# Altium schematic sheet Main.SchDoc
size A4; CompanyName: WEITI ISE; Address1: ul. Nowowiejska 15/19; Address2: 00-665 Warszawa; DocumentNumber: 1; SheetNumber: 1; SheetTotal: 7
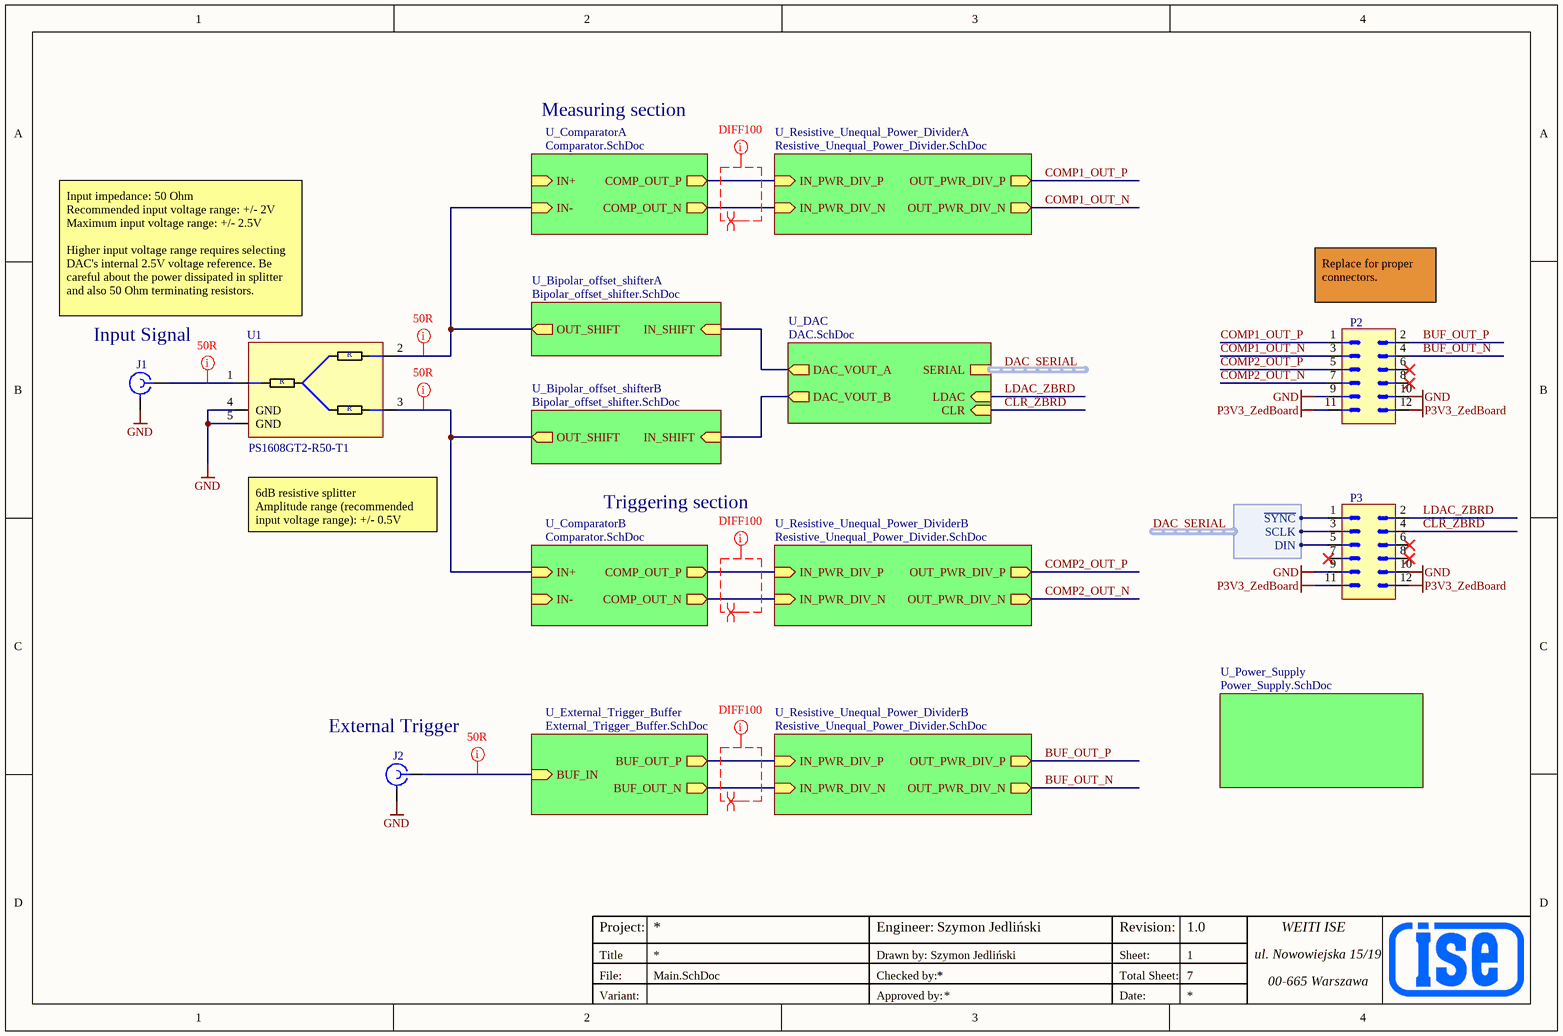
[diagram p0: Main.SchDoc]

## Parts
J1  CONSMA020.062-G  (value not drawn)
J2  CONSMA020.062-G  (value not drawn)
P2  DF11-12DP-2DSA  [DF11-12DP-2DSA]  (value not drawn)
P3  DF11-12DP-2DSA  [DF11-12DP-2DSA]  (value not drawn)
U1  PS1608GT2-R50-T1

## Sub-sheets
U_Bipolar_offset_shifterA = Bipolar_offset_shifter.SchDoc: OUT_SHIFT (out), IN_SHIFT (in)
U_Bipolar_offset_shifterB = Bipolar_offset_shifter.SchDoc: OUT_SHIFT (out), IN_SHIFT (in)
U_ComparatorA = Comparator.SchDoc: IN+ (in), IN- (in), COMP_OUT_P (out), COMP_OUT_N (out)
U_ComparatorB = Comparator.SchDoc: IN- (in), IN+ (in), COMP_OUT_P (out), COMP_OUT_N (out)
U_DAC = DAC.SchDoc: SERIAL (harness SERIAL_DAC), LDAC (in), CLR (in), DAC_VOUT_A (out), DAC_VOUT_B (out)
U_External_Trigger_Buffer = External_Trigger_Buffer.SchDoc: BUF_IN (in), BUF_OUT_P (out), BUF_OUT_N (out)
U_Power_Supply = Power_Supply.SchDoc: no entries
U_Resistive_Unequal_Power_DividerA = Resistive_Unequal_Power_Divider.SchDoc: IN_PWR_DIV_P (in), OUT_PWR_DIV_P (out), IN_PWR_DIV_N (in), OUT_PWR_DIV_N (out)
U_Resistive_Unequal_Power_DividerB = Resistive_Unequal_Power_Divider.SchDoc: IN_PWR_DIV_P (in), OUT_PWR_DIV_P (out), IN_PWR_DIV_N (in), OUT_PWR_DIV_N (out)
U_Resistive_Unequal_Power_DividerB = Resistive_Unequal_Power_Divider.SchDoc: IN_PWR_DIV_P (in), OUT_PWR_DIV_P (out), IN_PWR_DIV_N (in), OUT_PWR_DIV_N (out)

## Harnesses
SERIAL_DAC: DIN, SCLK, ~{SYNC}

## Nets
GND: J1.2 J2.2 P2.9 P2.10 P3.9 P3.10 U1.4(GND) U1.5(GND)
P3V3_ZedBoard: P2.11 P2.12 P3.11 P3.12
BUF_OUT_N: P2.4 ; sheet U_Resistive_Unequal_Power_DividerB/OUT_PWR_DIV_N
BUF_OUT_P: P2.2 ; sheet U_Resistive_Unequal_Power_DividerB/OUT_PWR_DIV_P
CLR_ZBRD: P3.4 ; sheet U_DAC/CLR
COMP1_OUT_N: P2.3 ; sheet U_Resistive_Unequal_Power_DividerA/OUT_PWR_DIV_N
COMP1_OUT_P: P2.1 ; sheet U_Resistive_Unequal_Power_DividerA/OUT_PWR_DIV_P
COMP2_OUT_N: P2.7 ; sheet U_Resistive_Unequal_Power_DividerB/OUT_PWR_DIV_N
COMP2_OUT_P: P2.5 ; sheet U_Resistive_Unequal_Power_DividerB/OUT_PWR_DIV_P
DAC_SERIAL~{.SYNC}: P3.1 ; sheet U_DAC/SERIAL.~{SYNC}
DAC_SERIAL.DIN: P3.5 ; sheet U_DAC/SERIAL.DIN
DAC_SERIAL.SCLK: P3.3 ; sheet U_DAC/SERIAL.SCLK
LDAC_ZBRD: P3.2 ; sheet U_DAC/LDAC
NetJ1_1: J1.1 U1.1
NetJ2_1: J2.1 ; sheet U_External_Trigger_Buffer/BUF_IN
NetU1_2: U1.2 ; sheet U_ComparatorA/IN-, sheet U_Bipolar_offset_shifterA/OUT_SHIFT
NetU1_3: U1.3 ; sheet U_ComparatorB/IN+, sheet U_Bipolar_offset_shifterB/OUT_SHIFT
(unnamed): sheet U_ComparatorA/COMP_OUT_P, sheet U_Resistive_Unequal_Power_DividerA/IN_PWR_DIV_P
(unnamed): sheet U_ComparatorA/COMP_OUT_N, sheet U_Resistive_Unequal_Power_DividerA/IN_PWR_DIV_N
(unnamed): sheet U_ComparatorB/COMP_OUT_P, sheet U_Resistive_Unequal_Power_DividerB/IN_PWR_DIV_P
(unnamed): sheet U_ComparatorB/COMP_OUT_N, sheet U_Resistive_Unequal_Power_DividerB/IN_PWR_DIV_N
(unnamed): sheet U_DAC/DAC_VOUT_A, sheet U_Bipolar_offset_shifterA/IN_SHIFT
(unnamed): sheet U_DAC/DAC_VOUT_B, sheet U_Bipolar_offset_shifterB/IN_SHIFT
(unnamed): sheet U_External_Trigger_Buffer/BUF_OUT_P, sheet U_Resistive_Unequal_Power_DividerB/IN_PWR_DIV_P
(unnamed): sheet U_External_Trigger_Buffer/BUF_OUT_N, sheet U_Resistive_Unequal_Power_DividerB/IN_PWR_DIV_N

Not connected (* = marked no-connect by the designer): P2 6* 8*; P3 6* 7* 8*

## Buses and harness runs
harness DAC_SERIAL = sheet U_DAC/SERIAL

## Layout directives
mark named 50R: NetJ1_1, NetJ2_1, NetU1_2, NetU1_3
differential pair: (no net found under the mark)
mark named DIFF100: (no net found under the mark)

## Notes on the sheet
- Measuring section
- (near U1) Input impedance: 50 Ohm
  Recommended input voltage range: +/- 2V
  Maximum input voltage range: +/- 2.5V
  Higher input voltage range requires selecting DAC's internal 2.5V voltage reference. Be careful about the power dissipated in splitter and also 50 Ohm terminating resistors.
- (near P2) Replace for proper connectors.
- Input Signal
- Triggering section
- 6dB resistive splitter
  Amplitude range (recommended input voltage range): +/- 0.5V
- (near J2) External Trigger
- Project:
- Title
- File:
- Drawn by:
- Engineer:
- Checked by:
- Szymon Jedliński
- Sheet:
- Revision:
- Total Sheet:
- 1.0
- Variant:
- Approved by:
- Date:
- (in symbol PS1608GT2-R50-T1) R

## Library data of the parts
J1 J2 = CONSMA020.062-G: Coaxial Connectors SMA, Edge Mount, Female Receptacle, 0.062" PCB Mount, Gold; Manufacturer 1 Component Height: 7.92mm; DesignItemId: CONSMA020.062-G; HelpURL: https://www.mouser.pl/datasheet/2/418/9/ENG_DS_L9000279_01_A-3238972.pdf; Manufacturer Part Number: CONSMA020.062-G; SMD: Yes
P2 P3 = DF11-12DP-2DSA(08): Socket wire-board, male, Pitch 2mm, PIN: 12; Manufacturer 1 Component Height: 6.6mm; DesignItemId: DF11-12DP-2DSA(08); HelpURL: https://pl.mouser.com/datasheet/2/185/DF11_CL0543_0521_2_08_2d-1611425.pdf; Manufacturer Part Number: DF11-12DP-2DSA; SMD: No
U1 = PS1608GT2-R50-T1: Signal Conditioning 50 ohm 2 terminal Power Splitter; Manufacturer 1 Component Height: 0.5mm; DesignItemId: PS1608GT2-R50-T1; HelpURL: https://www.mouser.pl/datasheet/2/392/n_catalog_partition31_en-1660522.pdf; Manufacturer Part Number: PS1608GT2-R50-T1; SMD: Yes; Value: PS1608GT2-R50-T1